# Altium schematic sheet ZHSD-ZYNQ-DDR.SchDoc
size A3; DocumentNumber: 6; SheetNumber: 6; SheetTotal: 17; Size: A3
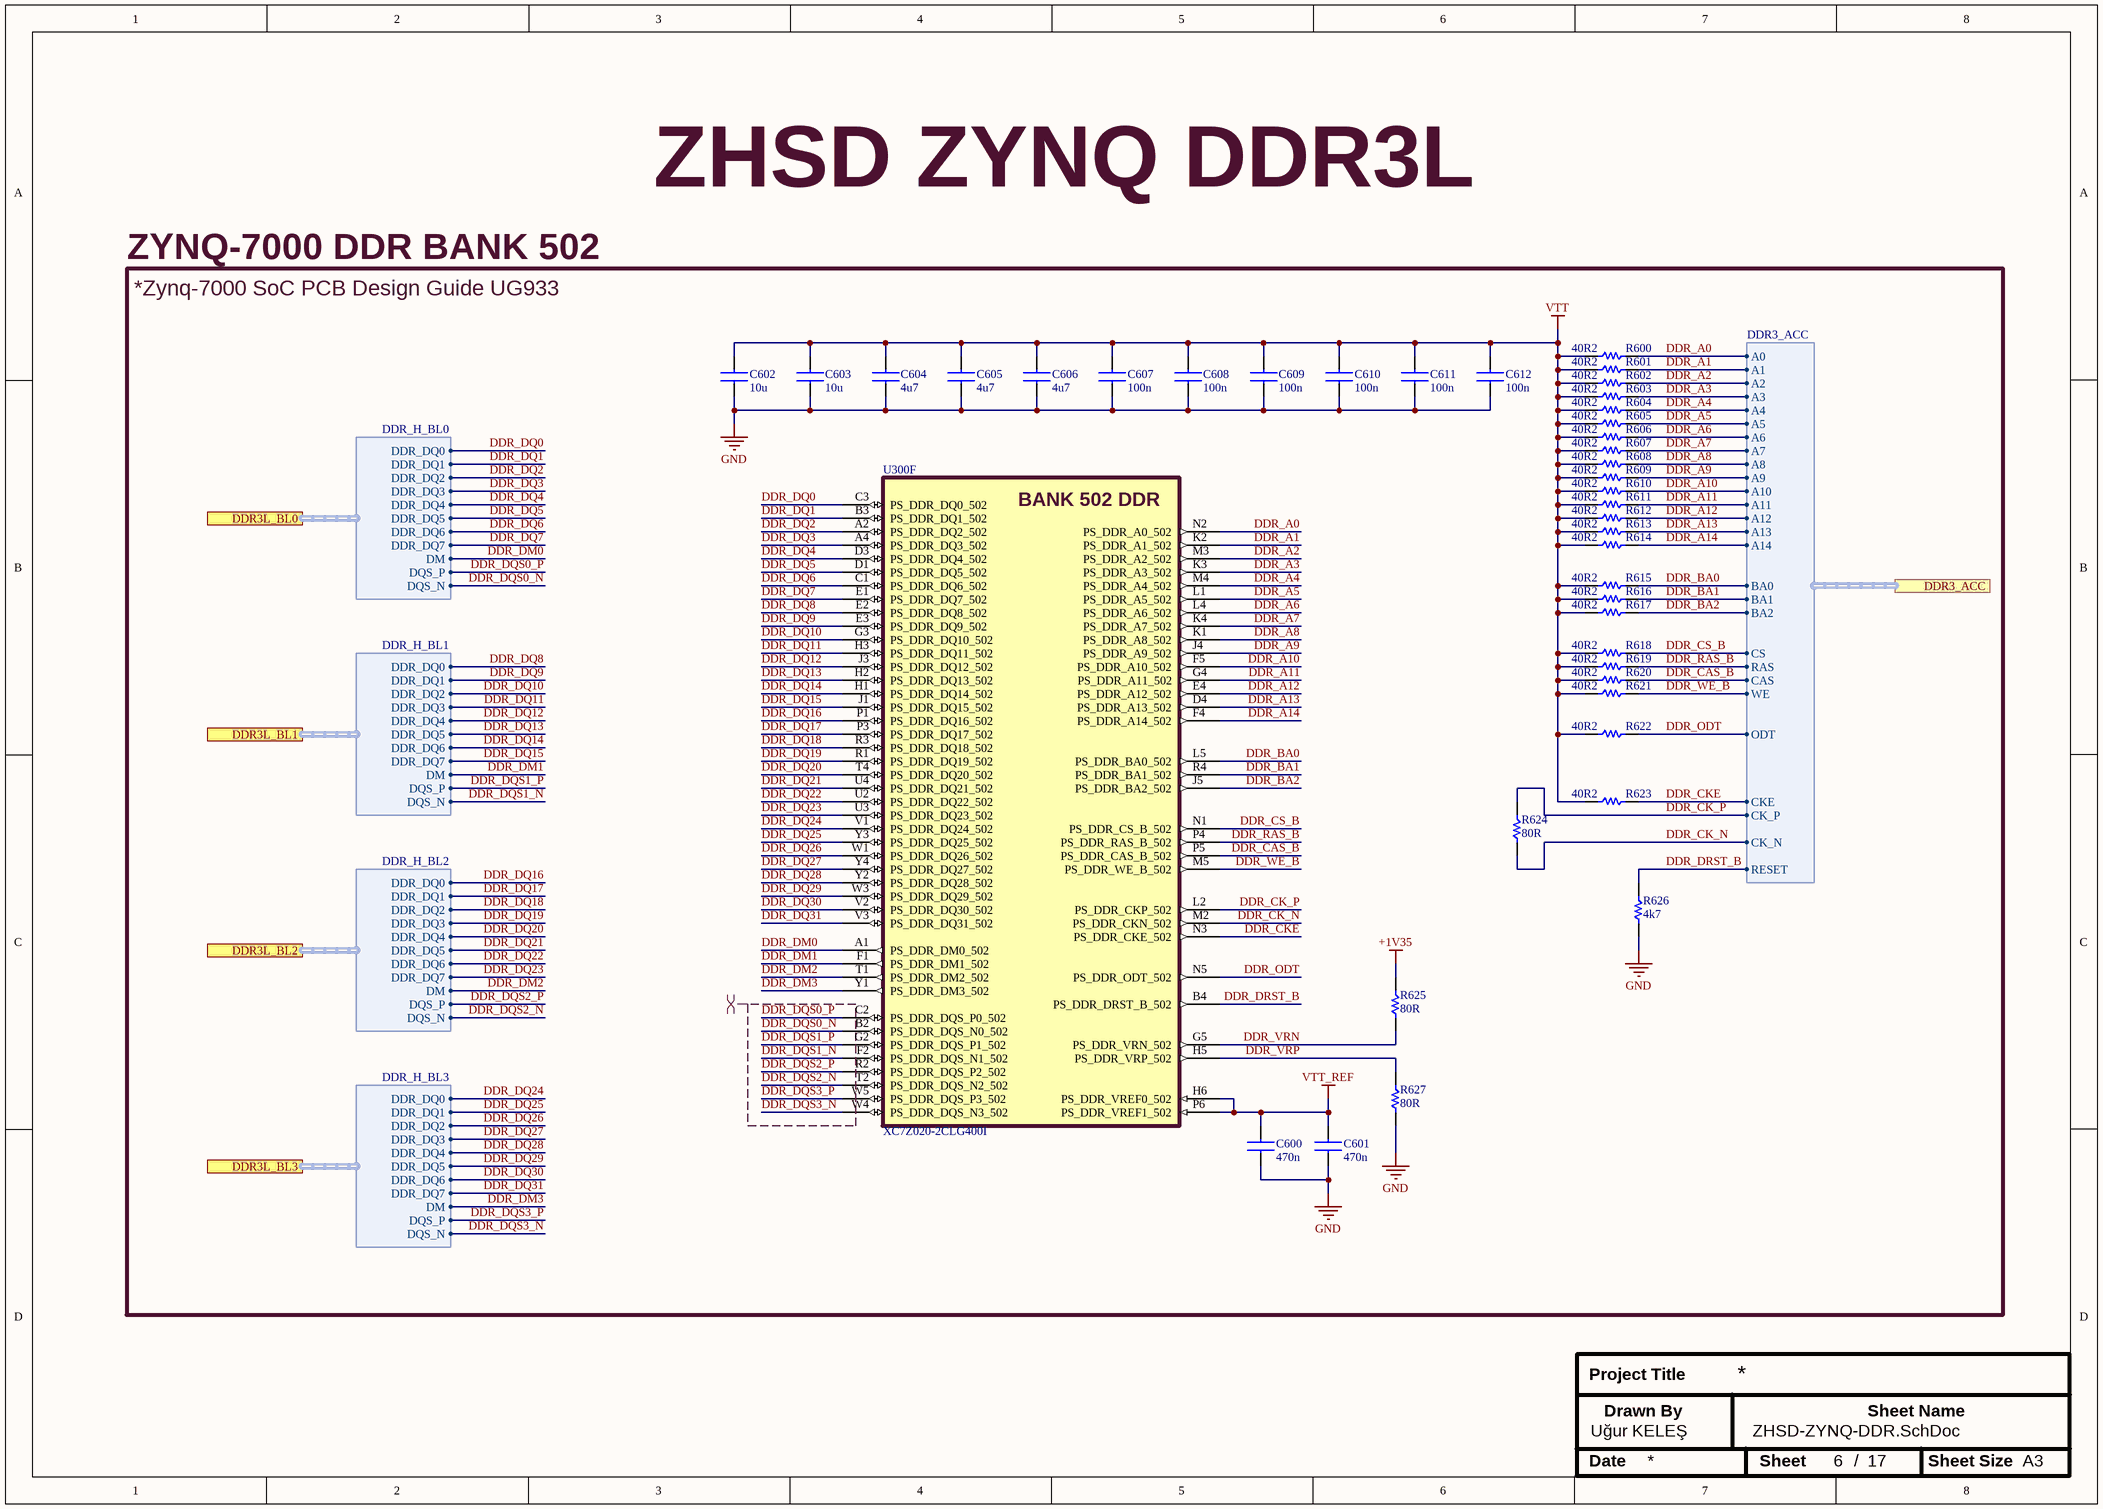
[diagram p0: ZHSD-ZYNQ-DDR.SchDoc]

## Parts
C600  470n  [0402CAPC1005X06N]
C601  470n  [0402CAPC1005X06N]
C602  10u  [0603CAPC1608X09N]
C603  10u  [0603CAPC1608X09N]
C604  4u7  [0603CAPC1608X09N]
C605  4u7  [0603CAPC1608X09N]
C606  4u7  [0603CAPC1608X09N]
C607  100n  [0603CAPC1608X09N]
C608  100n  [0603CAPC1608X09N]
C609  100n  [0603CAPC1608X09N]
C610  100n  [0603CAPC1608X09N]
C611  100n  [0603CAPC1608X09N]
C612  100n  [0603CAPC1608X09N]
R600  40R2  [0402RESC1005X04N]
R601  40R2  [0402RESC1005X04N]
R602  40R2  [0402RESC1005X04N]
R603  40R2  [0402RESC1005X04N]
R604  40R2  [0402RESC1005X04N]
R605  40R2  [0402RESC1005X04N]
R606  40R2  [0402RESC1005X04N]
R607  40R2  [0402RESC1005X04N]
R608  40R2  [0402RESC1005X04N]
R609  40R2  [0402RESC1005X04N]
R610  40R2  [0402RESC1005X04N]
R611  40R2  [0402RESC1005X04N]
R612  40R2  [0402RESC1005X04N]
R613  40R2  [0402RESC1005X04N]
R614  40R2  [0402RESC1005X04N]
R615  40R2  [0402RESC1005X04N]
R616  40R2  [0402RESC1005X04N]
R617  40R2  [0402RESC1005X04N]
R618  40R2  [0402RESC1005X04N]
R619  40R2  [0402RESC1005X04N]
R620  40R2  [0402RESC1005X04N]
R621  40R2  [0402RESC1005X04N]
R622  40R2  [0402RESC1005X04N]
R623  40R2  [0402RESC1005X04N]
R624  80R  [0402RESC1005X04N]
R625  80R  [0402RESC1005X04N]
R626  4k7  [0402RESC1005X04N]
R627  80R  [0402RESC1005X04N]
U300  XC7Z020-2CLG400I  [BGA400C80P20X20_1700X1700X147]  (part F of 8)

## Ports
DDR3_ACC (harness DDR3_ACC, see ZHSD-Block[7500,5000], ZHSD-DDR3L[800,7700]), DDR3L_BL0 (harness DDR_H_BL0, see ZHSD-Block[7500,5900], ZHSD-DDR3L[11900,8400]), DDR3L_BL1 (harness DDR_H_BL1, see ZHSD-Block[7500,5700], ZHSD-DDR3L[11900,6500]), DDR3L_BL2 (harness DDR_H_BL2, see ZHSD-Block[7500,5500], ZHSD-DDR3L[14300,8400]), DDR3L_BL3 (harness DDR_H_BL3, see ZHSD-Block[7500,5300], ZHSD-DDR3L[14300,6500])

## Harnesses
DDR_H_BL0: DDR_DQ0, DDR_DQ1, DDR_DQ2, DDR_DQ3, DDR_DQ4, DDR_DQ5, DDR_DQ6, DDR_DQ7, DM, DQS_P, DQS_N
DDR3_ACC: A0, A1, A2, A3, A4, A5, A6, A7, A8, A9, A10, A11, A12, A13, BA0, BA1, CK_P, CK_N, CKE, WE, CAS, RAS, CS, ODT, RESET, BA2, A14
DDR_H_BL1: DDR_DQ0, DDR_DQ1, DDR_DQ2, DDR_DQ3, DDR_DQ4, DDR_DQ5, DDR_DQ6, DDR_DQ7, DM, DQS_P, DQS_N
DDR_H_BL2: DDR_DQ0, DDR_DQ1, DDR_DQ2, DDR_DQ3, DDR_DQ4, DDR_DQ5, DDR_DQ6, DDR_DQ7, DM, DQS_P, DQS_N
DDR_H_BL3: DDR_DQ0, DDR_DQ1, DDR_DQ2, DDR_DQ3, DDR_DQ4, DDR_DQ5, DDR_DQ6, DDR_DQ7, DM, DQS_P, DQS_N

## Nets
+1V35: R625.2
GND: C600.1 C601.1 C602.1 C603.1 C604.1 C605.1 C606.1 C607.1 C608.1 C609.1 C610.1 C611.1 C612.1 R626.1 R627.1
VTT: C602.2 C603.2 C604.2 C605.2 C606.2 C607.2 C608.2 C609.2 C610.2 C611.2 C612.2 R600.1 R601.1 R602.1 R603.1 R604.1 R605.1 R606.1 R607.1 R608.1 R609.1 R610.1 R611.1 R612.1 R613.1 R614.1 R615.1 R616.1 R617.1 R618.1 R619.1 R620.1 R621.1 R622.1 R623.1
VTT_REF: C600.2 C601.2 U300.H6(PS_DDR_VREF0_502) U300.P6(PS_DDR_VREF1_502)
DDR_A0: R600.2 U300.N2(PS_DDR_A0_502) ; port DDR3_ACC.A0
DDR_A1: R601.2 U300.K2(PS_DDR_A1_502) ; port DDR3_ACC.A1
DDR_A2: R602.2 U300.M3(PS_DDR_A2_502) ; port DDR3_ACC.A2
DDR_A3: R603.2 U300.K3(PS_DDR_A3_502) ; port DDR3_ACC.A3
DDR_A4: R604.2 U300.M4(PS_DDR_A4_502) ; port DDR3_ACC.A4
DDR_A5: R605.2 U300.L1(PS_DDR_A5_502) ; port DDR3_ACC.A5
DDR_A6: R606.2 U300.L4(PS_DDR_A6_502) ; port DDR3_ACC.A6
DDR_A7: R607.2 U300.K4(PS_DDR_A7_502) ; port DDR3_ACC.A7
DDR_A8: R608.2 U300.K1(PS_DDR_A8_502) ; port DDR3_ACC.A8
DDR_A9: R609.2 U300.J4(PS_DDR_A9_502) ; port DDR3_ACC.A9
DDR_A10: R610.2 U300.F5(PS_DDR_A10_502) ; port DDR3_ACC.A10
DDR_A11: R611.2 U300.G4(PS_DDR_A11_502) ; port DDR3_ACC.A11
DDR_A12: R612.2 U300.E4(PS_DDR_A12_502) ; port DDR3_ACC.A12
DDR_A13: R613.2 U300.D4(PS_DDR_A13_502) ; port DDR3_ACC.A13
DDR_A14: R614.2 U300.F4(PS_DDR_A14_502) ; port DDR3_ACC.A14
DDR_BA0: R615.2 U300.L5(PS_DDR_BA0_502) ; port DDR3_ACC.BA0
DDR_BA1: R616.2 U300.R4(PS_DDR_BA1_502) ; port DDR3_ACC.BA1
DDR_BA2: R617.2 U300.J5(PS_DDR_BA2_502) ; port DDR3_ACC.BA2
DDR_CAS_B: R620.2 U300.P5(PS_DDR_CAS_B_502) ; port DDR3_ACC.CAS
DDR_CK_N: R624.1 U300.M2(PS_DDR_CKN_502) ; port DDR3_ACC.CK_N
DDR_CK_P: R624.2 U300.L2(PS_DDR_CKP_502) ; port DDR3_ACC.CK_P
DDR_CKE: R623.2 U300.N3(PS_DDR_CKE_502) ; port DDR3_ACC.CKE
DDR_CS_B: R618.2 U300.N1(PS_DDR_CS_B_502) ; port DDR3_ACC.CS
DDR_DM0: U300.A1(PS_DDR_DM0_502) ; port DDR3L_BL0.DM
DDR_DM1: U300.F1(PS_DDR_DM1_502) ; port DDR3L_BL1.DM
DDR_DM2: U300.T1(PS_DDR_DM2_502) ; port DDR3L_BL2.DM
DDR_DM3: U300.Y1(PS_DDR_DM3_502) ; port DDR3L_BL3.DM
DDR_DQ0: U300.C3(PS_DDR_DQ0_502) ; port DDR3L_BL0.DDR_DQ0
DDR_DQ1: U300.B3(PS_DDR_DQ1_502) ; port DDR3L_BL0.DDR_DQ1
DDR_DQ2: U300.A2(PS_DDR_DQ2_502) ; port DDR3L_BL0.DDR_DQ2
DDR_DQ3: U300.A4(PS_DDR_DQ3_502) ; port DDR3L_BL0.DDR_DQ3
DDR_DQ4: U300.D3(PS_DDR_DQ4_502) ; port DDR3L_BL0.DDR_DQ4
DDR_DQ5: U300.D1(PS_DDR_DQ5_502) ; port DDR3L_BL0.DDR_DQ5
DDR_DQ6: U300.C1(PS_DDR_DQ6_502) ; port DDR3L_BL0.DDR_DQ6
DDR_DQ7: U300.E1(PS_DDR_DQ7_502) ; port DDR3L_BL0.DDR_DQ7
DDR_DQ8: U300.E2(PS_DDR_DQ8_502) ; port DDR3L_BL1.DDR_DQ0
DDR_DQ9: U300.E3(PS_DDR_DQ9_502) ; port DDR3L_BL1.DDR_DQ1
DDR_DQ10: U300.G3(PS_DDR_DQ10_502) ; port DDR3L_BL1.DDR_DQ2
DDR_DQ11: U300.H3(PS_DDR_DQ11_502) ; port DDR3L_BL1.DDR_DQ3
DDR_DQ12: U300.J3(PS_DDR_DQ12_502) ; port DDR3L_BL1.DDR_DQ4
DDR_DQ13: U300.H2(PS_DDR_DQ13_502) ; port DDR3L_BL1.DDR_DQ5
DDR_DQ14: U300.H1(PS_DDR_DQ14_502) ; port DDR3L_BL1.DDR_DQ6
DDR_DQ15: U300.J1(PS_DDR_DQ15_502) ; port DDR3L_BL1.DDR_DQ7
DDR_DQ16: U300.P1(PS_DDR_DQ16_502) ; port DDR3L_BL2.DDR_DQ0
DDR_DQ17: U300.P3(PS_DDR_DQ17_502) ; port DDR3L_BL2.DDR_DQ1
DDR_DQ18: U300.R3(PS_DDR_DQ18_502) ; port DDR3L_BL2.DDR_DQ2
DDR_DQ19: U300.R1(PS_DDR_DQ19_502) ; port DDR3L_BL2.DDR_DQ3
DDR_DQ20: U300.T4(PS_DDR_DQ20_502) ; port DDR3L_BL2.DDR_DQ4
DDR_DQ21: U300.U4(PS_DDR_DQ21_502) ; port DDR3L_BL2.DDR_DQ5
DDR_DQ22: U300.U2(PS_DDR_DQ22_502) ; port DDR3L_BL2.DDR_DQ6
DDR_DQ23: U300.U3(PS_DDR_DQ23_502) ; port DDR3L_BL2.DDR_DQ7
DDR_DQ24: U300.V1(PS_DDR_DQ24_502) ; port DDR3L_BL3.DDR_DQ0
DDR_DQ25: U300.Y3(PS_DDR_DQ25_502) ; port DDR3L_BL3.DDR_DQ1
DDR_DQ26: U300.W1(PS_DDR_DQ26_502) ; port DDR3L_BL3.DDR_DQ2
DDR_DQ27: U300.Y4(PS_DDR_DQ27_502) ; port DDR3L_BL3.DDR_DQ3
DDR_DQ28: U300.Y2(PS_DDR_DQ28_502) ; port DDR3L_BL3.DDR_DQ4
DDR_DQ29: U300.W3(PS_DDR_DQ29_502) ; port DDR3L_BL3.DDR_DQ5
DDR_DQ30: U300.V2(PS_DDR_DQ30_502) ; port DDR3L_BL3.DDR_DQ6
DDR_DQ31: U300.V3(PS_DDR_DQ31_502) ; port DDR3L_BL3.DDR_DQ7
DDR_DQS0_N: U300.B2(PS_DDR_DQS_N0_502) ; port DDR3L_BL0.DQS_N
DDR_DQS0_P: U300.C2(PS_DDR_DQS_P0_502) ; port DDR3L_BL0.DQS_P
DDR_DQS1_N: U300.F2(PS_DDR_DQS_N1_502) ; port DDR3L_BL1.DQS_N
DDR_DQS1_P: U300.G2(PS_DDR_DQS_P1_502) ; port DDR3L_BL1.DQS_P
DDR_DQS2_N: U300.T2(PS_DDR_DQS_N2_502) ; port DDR3L_BL2.DQS_N
DDR_DQS2_P: U300.R2(PS_DDR_DQS_P2_502) ; port DDR3L_BL2.DQS_P
DDR_DQS3_N: U300.W4(PS_DDR_DQS_N3_502) ; port DDR3L_BL3.DQS_N
DDR_DQS3_P: U300.W5(PS_DDR_DQS_P3_502) ; port DDR3L_BL3.DQS_P
DDR_DRST_B: R626.2 U300.B4(PS_DDR_DRST_B_502) ; port DDR3_ACC.RESET
DDR_ODT: R622.2 U300.N5(PS_DDR_ODT_502) ; port DDR3_ACC.ODT
DDR_RAS_B: R619.2 U300.P4(PS_DDR_RAS_B_502) ; port DDR3_ACC.RAS
DDR_VRN: R625.1 U300.G5(PS_DDR_VRN_502)
DDR_VRP: R627.2 U300.H5(PS_DDR_VRP_502)
DDR_WE_B: R621.2 U300.M5(PS_DDR_WE_B_502) ; port DDR3_ACC.WE

## Layout directives
differential pair: DDR_DQS0_N, DDR_DQS0_P, DDR_DQS1_N, DDR_DQS1_P, DDR_DQS2_N, DDR_DQS2_P, DDR_DQS3_N, DDR_DQS3_P

## Notes on the sheet
- ZHSD ZYNQ DDR3L
- ZYNQ-7000 DDR BANK 502
- *Zynq-7000 SoC PCB Design Guide UG933
- Project Title
- Uğur KELEŞ
- Drawn By
- Sheet Name
- Date
- Sheet
- /
- Sheet Size
- A3
- (in symbol XC7Z020-2CLG400I, part F) BANK 502 DDR

## Library data of the parts
C600 C601 = GRM155R60J474KE19D: CAP CER 0.47UF 6.3V X5R 0402(1005) ±10%; Manufacturer: Murata Electronics; Value: 0.47 µF; ComponentLink1Description: Datasheet; ComponentLink1URL: https://search.murata.co.jp/Ceramy/image/img/A01X/G101/ENG/GRM21BR71A475KE51-01.pdf; MPN: GRM155R60J474KE19D; Package: 0402; Tolerance: ±10%; Voltage: 6.3V
C602 C603 = GRM188Z71A106MA73D: CAP CER 10UF 10V X7R 0603 (1608) ±20%; Manufacturer: Murata Electronics; Value: 10 µF; ComponentLink1Description: Datasheet; ComponentLink1URL: https://search.murata.co.jp/Ceramy/image/img/A01X/G101/ENG/GRM188Z71A106MA73-01A.pdf; MPN: GRM188Z71A106MA73D; Package: 0603; Tolerance: ±20%; Voltage: 10V
C604-C606 = CL10A475KP8NNNC: CAP CER 4.7UF 10V X5R 0603 (1608) ±10%; Manufacturer: Samsung Electro-Mechanics; Value: 4.7 µF; ComponentLink1Description: Datasheet; ComponentLink1URL: https://mm.digikey.com/Volume0/opasdata/d220001/medias/docus/609/CL10A475KP8NNNC_Spec.pdf; MPN: CL10A475KP8NNNC; Package: 0603; Tolerance: ±10%; Voltage: 10V
C607-C612 = GRM155R71C104KA88J: CAP CER 0.1UF 16V X7R 0402 (1005) ±10%; Manufacturer: Murata Electronics; Value: 0.1 µF; ComponentLink1Description: Datasheet; ComponentLink1URL: https://search.murata.co.jp/Ceramy/image/img/A01X/G101/ENG/GRM155R71C104KA88-01.pdf; MPN: GRM155R71C104KA88J; Package: 0402; Tolerance: ±10%; Voltage: 16V
R600-R623 = RC0402FR-0740R2L: RES 40.2 OHM 1% 1/16W 0402 (1005); Manufacturer: YAGEO; Value: 40.2 Ohms; Voltage: 50V; ComponentLink1Description: Datasheet; ComponentLink1URL: https://yageogroup.com/content/datasheet/asset/file/PYU-RC_GROUP_51_ROHS_L; MPN: RC0402FR-0740R2L; Tolerance: ±1%; Package: 0402
R624 R625 R627 = RT0402FRE0780RL: RES 80 OHM 1% 1/16W 0402 (1005); Manufacturer: YAGEO; Value: 80 Ohms; Voltage: 50V; ComponentLink1Description: Datasheet; ComponentLink1URL: https://yageogroup.com/content/datasheet/asset/file/PYU-RT_1-TO-0-01_ROHS_L; MPN: RT0402FRE0780RL; Tolerance: ±1%; Package: 0402
R626 = RC0402JR-074K7L: RES 4.7K OHM 5% 1/16W 0402 (1005); Manufacturer: YAGEO; MPN: RT0402FRE0780RL; Value: 4.7 kOhms; Voltage: 50V; ComponentLink1Description: Datasheet; ComponentLink1URL: https://yageogroup.com/content/datasheet/asset/file/PYU-RC_GROUP_51_ROHS_L; Tolerance: ±5%; Package: 0402
U300 = XC7Z020-2CLG400I: Dual ARM® Cortex®-A9 MPCore™ with CoreSight™ System On Chip (SOC) IC Zynq®-7000 Artix™-7 FPGA, 85K Logic Cells 766MHz 400-CSPBGA (17x17); Manufacturer: AMD/XILINX; MPN: XC7Z020-2CLG400I; ComponentLink1Description: Datasheet; ComponentLink1URL: https://docs.amd.com/v/u/en-US/ds190-Zynq-7000-Overview; ComponentLink2Description: DC and AC Switching Characteristics; ComponentLink2URL: https://docs.amd.com/v/u/en-US/ds187-XC7Z010-XC7Z020-Data-Sheet; ComponentLink3Description: PCB Design Guide; ComponentLink3URL: https://docs.amd.com/v/u/en-US/ug933-Zynq-7000-PCB; ComponentLink4Description: Packaging and Pinout; ComponentLink4URL: https://docs.amd.com/v/u/en-US/ug865-Zynq-7000-Pkg-Pinout; ComponentLink5Description: Zynq 7000 SoC Technical Reference Manual; ComponentLink5URL: https://docs.amd.com/r/en-US/ug585-zynq-7000-SoC-TRM